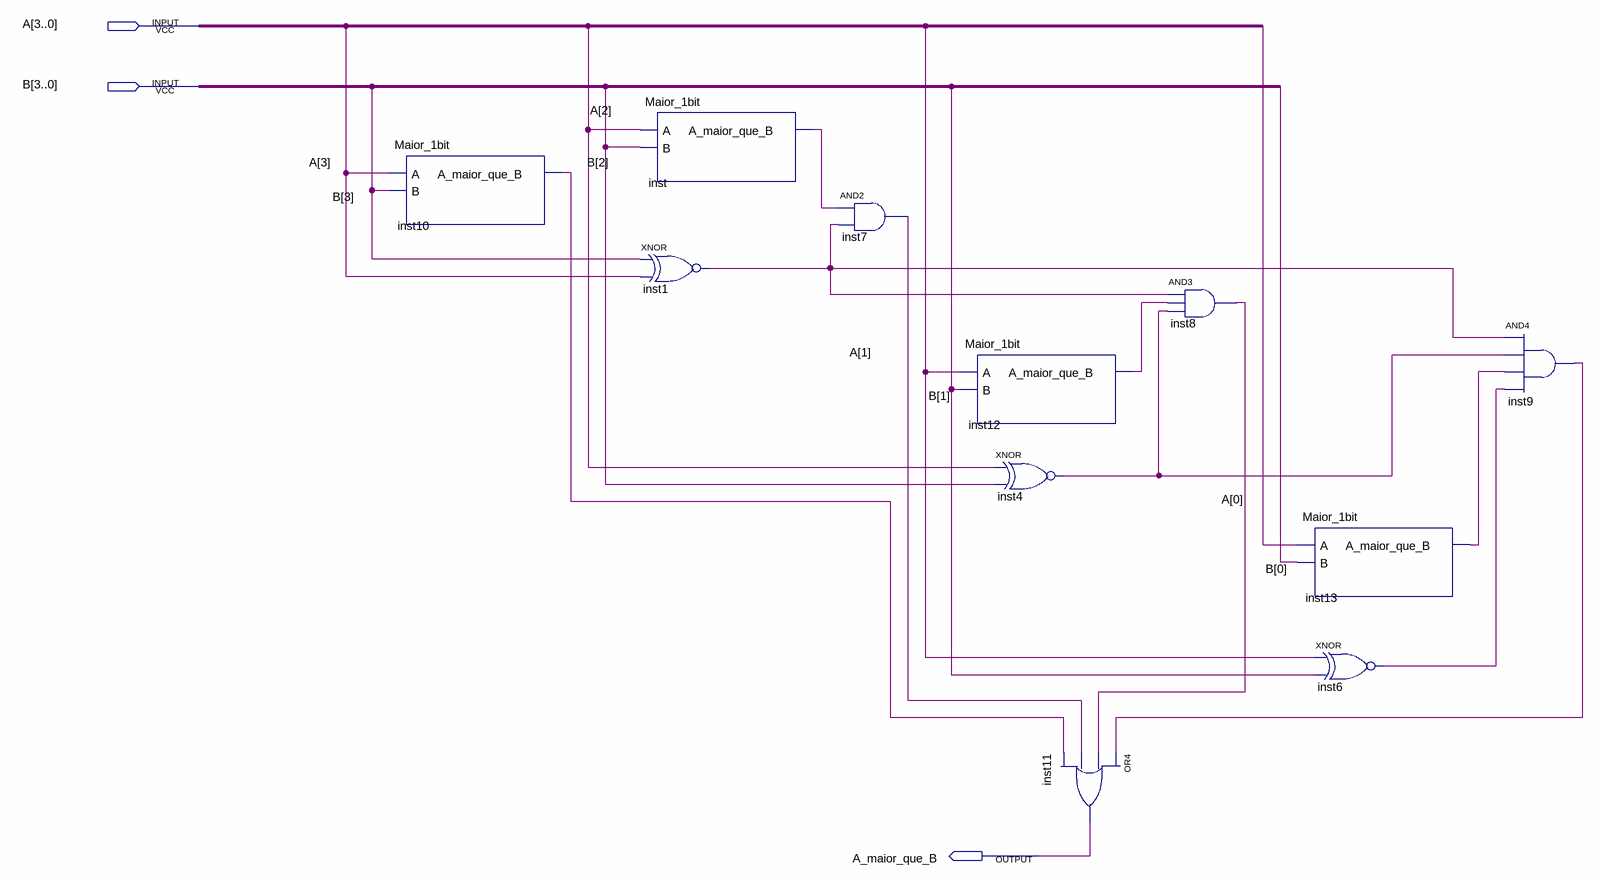
[diagram p0: schematic sheet]
// Quartus schematic Maior_4bits.bdf as structural Verilog: 11 symbols, 3 pins
module Maior_4bits (
  input  [3:0] A,
  input  [3:0] B,
  output A_maior_que_B
);

  wire inst1_out, inst4_out, inst6_out, inst7_out, inst8_out, inst9_out, inst10_a_maior_que_b,
       inst12_a_maior_que_b, inst13_a_maior_que_b, inst_a_maior_que_b;

  Maior_1bit inst10 (.A(A[3]), .B(B[3]), .A_maior_que_B(inst10_a_maior_que_b));
  Maior_1bit inst (.A(A[2]), .B(B[2]), .A_maior_que_B(inst_a_maior_que_b));
  xnor inst1 (inst1_out, B[3], A[3]);
  and inst7 (inst7_out, inst_a_maior_que_b, inst1_out);
  Maior_1bit inst12 (.A(A[1]), .B(B[1]), .A_maior_que_B(inst12_a_maior_que_b));
  xnor inst4 (inst4_out, A[2], B[2]);
  or inst11 (A_maior_que_B, inst9_out, inst8_out, inst7_out, inst10_a_maior_que_b);
  and inst8 (inst8_out, inst1_out, inst12_a_maior_que_b, inst4_out);
  Maior_1bit inst13 (.A(A[0]), .B(B[0]), .A_maior_que_B(inst13_a_maior_que_b));
  xnor inst6 (inst6_out, A[1], B[1]);
  and inst9 (inst9_out, inst1_out, inst4_out, inst13_a_maior_que_b, inst6_out);
endmodule
